# Altium schematic sheet driver_T_1.SchDoc
size A4
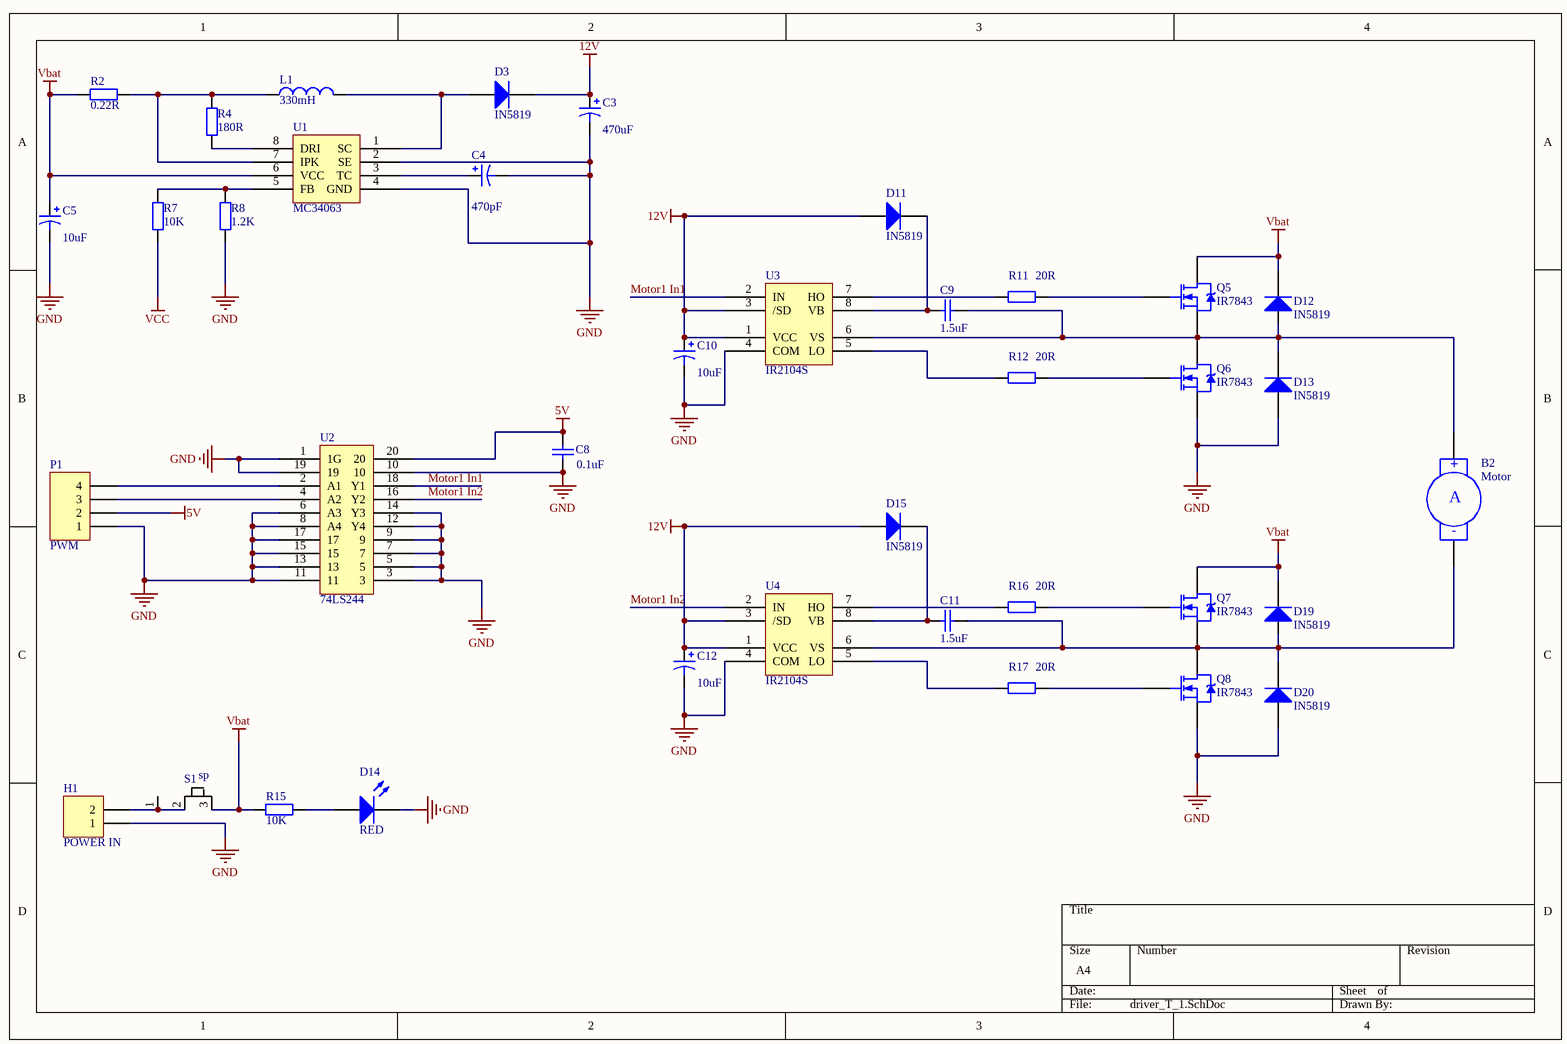
[diagram p0: driver_T_1.SchDoc]

## Parts
B2  Motor  [KF301-2P]
C3  value 470uF  [RB5-10.5]  (hidden comment: Cap Pol1)
C4  value 470pF  [0805(2012)]  (hidden comment: Cap Pol1)
C5  value 10uF  [0805(2012)]  (hidden comment: Cap Pol1)
C8  value 0.1uF  [0805(2012)]  (hidden comment: Cap)
C9  value 1.5uF  [0805(2012)]  (hidden comment: Cap)
C10  value 10uF  [0805(2012)]  (hidden comment: Cap Pol1)
C11  value 1.5uF  [0805(2012)]  (hidden comment: Cap)
C12  value 10uF  [0805(2012)]  (hidden comment: Cap Pol1)
D3  IN5819  [0805(2012)]
D11  IN5819  [0805(2012)]
D12  IN5819  [0805(2012)]
D13  IN5819  [0805(2012)]
D14  RED  [0805]
D15  IN5819  [0805(2012)]
D19  IN5819  [0805(2012)]
D20  IN5819  [0805(2012)]
H1  POWER IN  [KF301-2P]
L1  value 330mH  [电感8*8]  (hidden comment: Inductor)
P1  PWM  [PIN-4]
Q5  IR7843  [LR7843]
Q6  IR7843  [LR7843]
Q7  IR7843  [LR7843]
Q8  IR7843  [LR7843]
R2  value 0.22R  [0805(2012)]  (hidden comment: Res2)
R4  value 180R  [0805(2012)]  (hidden comment: Res2)
R7  value 10K  [0805(2012)]  (hidden comment: Res2)
R8  value 1.2K  [0805(2012)]  (hidden comment: Res2)
R11  value 20R  [0805(2012)]  (hidden comment: Res2)
R12  value 20R  [0805(2012)]  (hidden comment: Res2)
R15  value 10K  [0603]  (hidden comment: Res2)
R16  value 20R  [0805(2012)]  (hidden comment: Res2)
R17  value 20R  [0805(2012)]  (hidden comment: Res2)
S1  sp  [SWICH-3]
U1  MC34063  [MC34063]
U2  74LS244  [74LS244]
U3  IR2104S  [IR2104S]
U4  IR2104S  [IR2104S]

## Nets
5V: C8.2 P1.2 U2.20
12V: C3.1 C10.1 C12.1 D3.2(K) D11.1(A) D15.1(A) U3.1(VCC) U3.3(/SD) U4.1(VCC) U4.3(/SD)
GND: C3.2 C4.2 C5.2 C8.1 C10.2 C12.2 D13.1(A) D14.2(K) D20.1(A) H1.1 P1.1 Q6.3(S) Q8.3(S) R8.1 U1.2(SE) U1.4(GND) U2.1(1G) U2.3 U2.5 U2.6(A3) U2.7 U2.8(A4) U2.9 U2.10 U2.11 U2.12(Y4) U2.13 U2.14(Y3) U2.15 U2.17 U2.19 U3.4(COM) U4.4(COM)
Vbat: C5.1 D12.2(K) D19.2(K) Q5.2(D) Q7.2(D) R2.1 R15.1 S1.3 U1.6(VCC)
VCC: R7.1
Motor1 In1: U2.18(Y1) U3.2(IN)
Motor1 In2: U2.16(Y2) U4.2(IN)
NetB2_1: B2.1(+) C9.1 D12.1(A) D13.2(K) Q5.3(S) Q6.2(D) U3.6(VS)
NetB2_2: B2.2(-) C11.1 D19.1(A) D20.2(K) Q7.3(S) Q8.2(D) U4.6(VS)
NetC4_1: C4.1 U1.3(TC)
NetC9_2: C9.2 D11.2(K) U3.8(VB)
NetC11_2: C11.2 D15.2(K) U4.8(VB)
NetD3_1: D3.1(A) L1.2 U1.1(SC)
NetD14_1: D14.1(A) R15.2
NetH1_2: H1.2 S1.1 S1.2
NetL1_1: L1.1 R2.2 R4.2 U1.7(IPK)
NetP1_3: P1.3 U2.4(A2)
NetP1_4: P1.4 U2.2(A1)
NetQ5_1: Q5.1(G) R11.2
NetQ6_1: Q6.1(G) R12.2
NetQ7_1: Q7.1(G) R16.2
NetQ8_1: Q8.1(G) R17.2
NetR4_1: R4.1 U1.8(DRI)
NetR7_2: R7.2 R8.2 U1.5(FB)
NetR11_1: R11.1 U3.7(HO)
NetR12_1: R12.1 U3.5(LO)
NetR16_1: R16.1 U4.7(HO)
NetR17_1: R17.1 U4.5(LO)

## Notes on the sheet
- (in symbol Motor Servo) A

## Library data of the parts
B2 = Motor Servo: Servo Motor; Published: 24-Mar-1999; LatestRevisionDate: 17-Jul-2002; LatestRevisionNote: Re-released for DXP Platform.; PackageReference: RAD-0.4; Publisher: Altium Limited; PackageDescription: Radial Cap, Thru-Hole; 2 Leads; 0.4 in Pin Spacing
C3-C5 C10 C12 = Cap Pol1: Polarized Capacitor (Radial); Published: 8-Jun-2000; LatestRevisionDate: 17-Jul-2002; LatestRevisionNote: Re-released for DXP Platform.; PackageReference: RB7.6-15; Publisher: Altium Limited; PackageDescription: Polarized Capacitor (Radial); 2 Leads
C8 C9 C11 = Cap: Capacitor; Published: 8-Jun-2000; LatestRevisionDate: 17-Jul-2002; LatestRevisionNote: Re-released for DXP Platform.; PackageReference: RAD-0.3; Publisher: Altium Limited; PackageDescription: Radial Cap, Thru-Hole; 2 Leads; 0.3 in Pin Spacing
D3 D11-D13 D15 D19 D20 = Diode: Default Diode; Published: 8-Jun-2000; LatestRevisionDate: 17-Jul-2002; LatestRevisionNote: Re-released for DXP Platform.; PackageVersion: Sep-1996; PackageReference: SMC; Publisher: Altium Limited; PackageDescription: DO-214-AB/SMC; 2 C-Bend Leads; Body 7.9 x 5.9 mm, inc. leads (LxW); Code_JEDEC: DO-214-AB
D14 = LED2: Typical RED, GREEN, YELLOW, AMBER GaAs LED; Published: 8-Jun-2000; LatestRevisionDate: 17-Jul-2002; LatestRevisionNote: Re-released for DXP Platform.; PackageVersion: Feb-2002; PackageReference: 3.2X1.6X1.1; Publisher: Altium Limited; PackageDescription: SM LED; 2 Flat Leads
H1 = Header 2H: Header, 2-Pin, Right Angle; LatestRevisionDate: 17-Jul-2002; LatestRevisionNote: Re-released for DXP Platform.; Publisher: Altium Limited
L1 = Inductor: Code_IEC: 1005; Published: 8-Jun-2000; LatestRevisionDate: 29-May-2009; LatestRevisionNote: IPC-7351 Footprint Added.; PackageReference: 0402-A; Publisher: Altium Limited; PackageDescription: Chip Inductor; Code_JEITA: 0402
P1 = Header 4: Header, 4-Pin; LatestRevisionDate: 17-Jul-2002; LatestRevisionNote: Re-released for DXP Platform.; Publisher: Altium Limited
Q5-Q8 = IR7843: N-Channel Power MOSFET; Note: Pin 2 is electrically connected to pin 4.; Published: 8-Jun-2000; LatestRevisionDate: 17-Jul-2002; LatestRevisionNote: Re-released for DXP Platform.; DatasheetVersion: PD-9.814; PackageVersion: Feb-1997; PackageReference: TO-220AB; Publisher: Altium Limited; PackageDescription: TO, Thru-Hole, Vertical, Heatsink Mounted; 3 In-Line Leads; Pitch 2.54 mm; ComponentLink1Description: Manufacturer Link; ComponentLink1URL: http://www.irf.com/
R2 R4 R7 R8 R11 R12 R15-R17 = Res2: Resistor; Published: 8-Jun-2000; LatestRevisionDate: 17-Jul-2002; LatestRevisionNote: Re-released for DXP Platform.; PackageReference: AXIAL-0.4; Publisher: Altium Limited; PackageDescription: Axial Device, Thru-Hole; 2 Leads; 0.4 in Pin Spacing